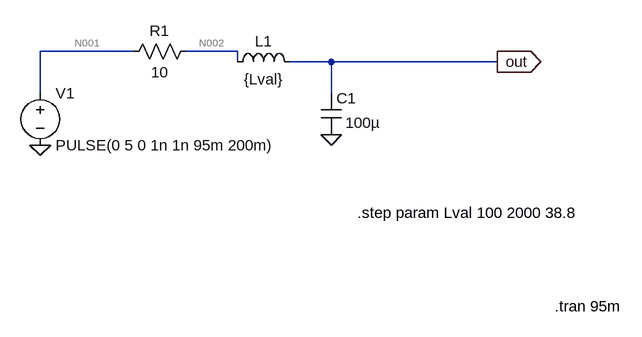
[diagram p0: schematic rlc_short_sweep.asc]
rlc_short_sweep.asc, the LTspice schematic file:
Version 4.1
SHEET 1 880 680
WIRE -688 -1136 -832 -1136
WIRE -528 -1136 -608 -1136
WIRE -528 -1120 -528 -1136
WIRE -384 -1120 -448 -1120
WIRE -128 -1120 -384 -1120
WIRE -832 -1072 -832 -1136
WIRE -384 -1072 -384 -1120
FLAG -832 -992 0
FLAG -384 -1008 0
FLAG -128 -1120 out
IOPIN -128 -1120 Out
SYMBOL voltage -832 -1088 R0
WINDOW 123 0 0 Left 0
WINDOW 39 0 0 Left 0
SYMATTR InstName V1
SYMATTR Value PULSE(0 5 0 1n 1n 95m 200m)
SYMBOL res -592 -1152 R90
WINDOW 0 0 56 VBottom 2
WINDOW 3 32 56 VTop 2
SYMATTR InstName R1
SYMATTR Value 10
SYMBOL ind -544 -1104 R270
WINDOW 0 32 56 VTop 2
WINDOW 3 5 56 VBottom 2
SYMATTR InstName L1
SYMATTR Value {Lval}
SYMATTR SpiceLine Rser=1m
SYMBOL cap -400 -1072 R0
WINDOW 3 38 46 Left 2
SYMATTR Value 100µ
SYMATTR InstName C1
TEXT -40 -744 Left 2 !.tran 95m
TEXT -344 -888 Left 2 !.step param Lval 100 2000 38.8

The netlist it stands for:
* rlc_short_sweep.asc
V1 N001 0 PULSE(0 5 0 1n 1n 95m 200m)
R1 N002 N001 10
L1 N002 out {Lval} Rser=1m
C1 out 0 100µ
.tran 95m
.step param Lval 100 2000 38.8
.backanno
.end

* Results of the author's LTspice run, read from the files saved beside the schematic
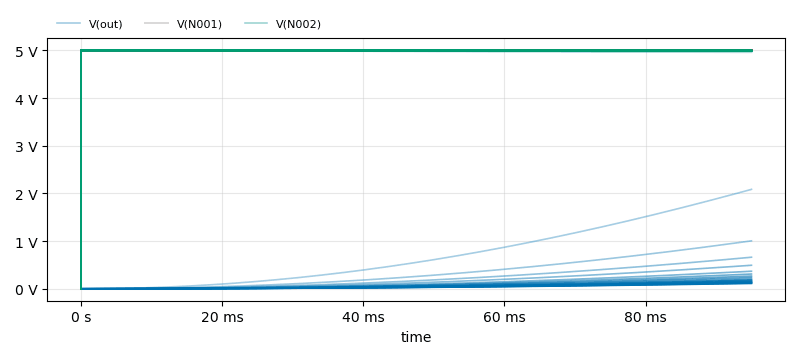
[diagram p1: Transient Analysis of rlc_short_sweep.asc, plotted from the saved traces]
* Transient Analysis, 50 runs:
*   V(out) [run 1]: min 0 V, max 2.085 V, average 717.2 mV, rms 953.7 mV, last 2.085 V
*   V(out) [run 2]: min 0 V, max 1.005 V, average 340 mV, rms 454.3 mV, last 1.005 V
*   V(out) [run 3]: min 0 V, max 662.1 mV, average 222.8 mV, rms 298.1 mV, last 662.1 mV
*   V(out) [run 4]: min 0 V, max 493.6 mV, average 165.7 mV, rms 221.8 mV, last 493.6 mV
*   V(out) [run 5]: min 0 V, max 368.5 mV, average 123.5 mV, rms 165.4 mV, last 368.5 mV
*   V(out) [run 6]: min 0 V, max 309.6 mV, average 103.7 mV, rms 138.9 mV, last 309.6 mV
*   V(out) [run 7]: min 0 V, max 267 mV, average 89.32 mV, rms 119.7 mV, last 267 mV
*   V(out) [run 8]: min 0 V, max 234.7 mV, average 78.48 mV, rms 105.2 mV, last 234.7 mV
*   V(N001) [run 1]: min 0 V, max 5 V, average 5 V, rms 5 V, last 5 V
*   V(N001) [run 2]: min 0 V, max 5 V, average 5 V, rms 5 V, last 5 V
*   V(N001) [run 3]: min 0 V, max 5 V, average 5 V, rms 5 V, last 5 V
*   V(N001) [run 4]: min 0 V, max 5 V, average 5 V, rms 5 V, last 5 V
*   V(N001) [run 5]: min 0 V, max 5 V, average 5 V, rms 5 V, last 5 V
*   V(N001) [run 6]: min 0 V, max 5 V, average 5 V, rms 5 V, last 5 V
*   V(N001) [run 7]: min 0 V, max 5 V, average 5 V, rms 5 V, last 5 V
*   V(N001) [run 8]: min 0 V, max 5 V, average 5 V, rms 5 V, last 5 V
*   V(N002) [run 1]: min 0 V, max 5 V, average 4.978 V, rms 4.978 V, last 4.96 V
*   V(N002) [run 2]: min 0 V, max 5 V, average 4.989 V, rms 4.989 V, last 4.98 V
*   V(N002) [run 3]: min 0 V, max 5 V, average 4.993 V, rms 4.993 V, last 4.986 V
*   V(N002) [run 4]: min 0 V, max 5 V, average 4.995 V, rms 4.995 V, last 4.99 V
*   V(N002) [run 5]: min 0 V, max 5 V, average 4.996 V, rms 4.996 V, last 4.992 V
*   V(N002) [run 6]: min 0 V, max 5 V, average 4.997 V, rms 4.997 V, last 4.994 V
*   V(N002) [run 7]: min 0 V, max 5 V, average 4.997 V, rms 4.997 V, last 4.994 V
*   V(N002) [run 8]: min 0 V, max 5 V, average 4.998 V, rms 4.998 V, last 4.995 V